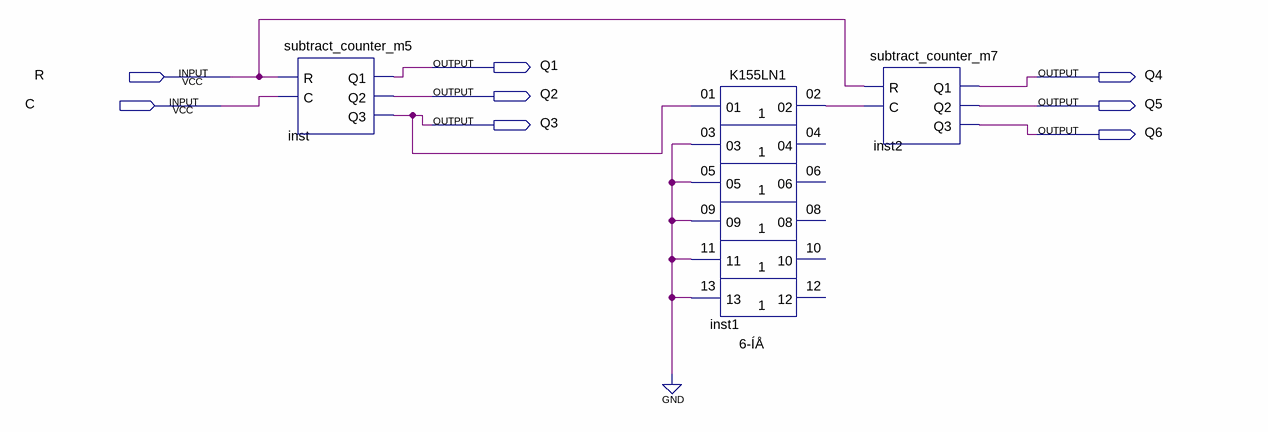
[diagram p0: schematic sheet]
// Quartus schematic scheme.bdf as structural Verilog: 3 symbols, 8 pins
module scheme (
  input  R,
  input  C,
  output Q1,
  output Q4,
  output Q2,
  output Q5,
  output Q3,
  output Q6
);

  wire inst1_02;

  subtract_counter_m5 inst (.R(R), .C(C), .Q1(Q1), .Q2(Q2), .Q3(Q3));
  K155LN1 inst1 (
    .\01 (Q3), .\03 (1'b0), .\05 (1'b0), .\09 (1'b0), .\11 (1'b0), .\13 (1'b0), .\02 (inst1_02));  // open: 04, 06, 08, 10, 12
  subtract_counter_m7 inst2 (.R(R), .C(inst1_02), .Q1(Q4), .Q2(Q5), .Q3(Q6));
endmodule
